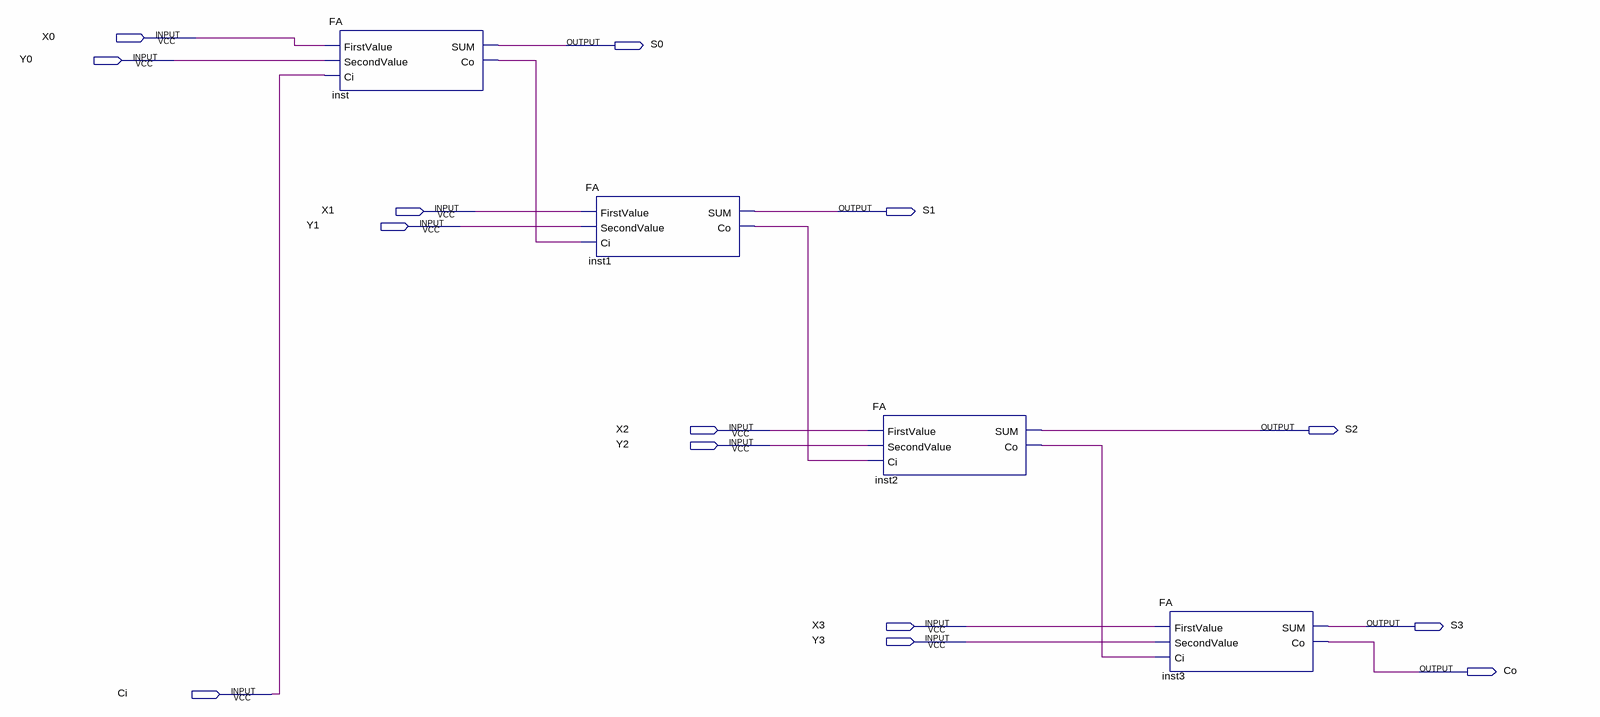
[diagram p0: schematic sheet]
// Quartus schematic 4BitAdder.bdf as structural Verilog: 4 symbols, 14 pins
module \4BitAdder  (
  input  X0,
  input  Y0,
  input  X1,
  input  Y1,
  input  X2,
  input  Y2,
  input  X3,
  input  Y3,
  input  Ci,
  output S0,
  output S1,
  output S2,
  output S3,
  output Co
);

  wire inst1_co, inst2_co, inst_co;

  FA inst (.FirstValue(X0), .SecondValue(Y0), .Ci(Ci), .SUM(S0), .Co(inst_co));
  FA inst1 (.FirstValue(X1), .SecondValue(Y1), .Ci(inst_co), .SUM(S1), .Co(inst1_co));
  FA inst2 (.FirstValue(X2), .SecondValue(Y2), .Ci(inst1_co), .SUM(S2), .Co(inst2_co));
  FA inst3 (.FirstValue(X3), .SecondValue(Y3), .Ci(inst2_co), .SUM(S3), .Co(Co));
endmodule
